# EasyEDA Pro project can-mcu.eprj, schematic main-board
Board Name: main-board; Create Date: 2026-08-05; Page Name: P1; Project Name: can-mcu; Schematic Name: main-board; Update Date: 2026-09-08; Company: EasyEDA.com; Page Size: A4; Version: V1.0
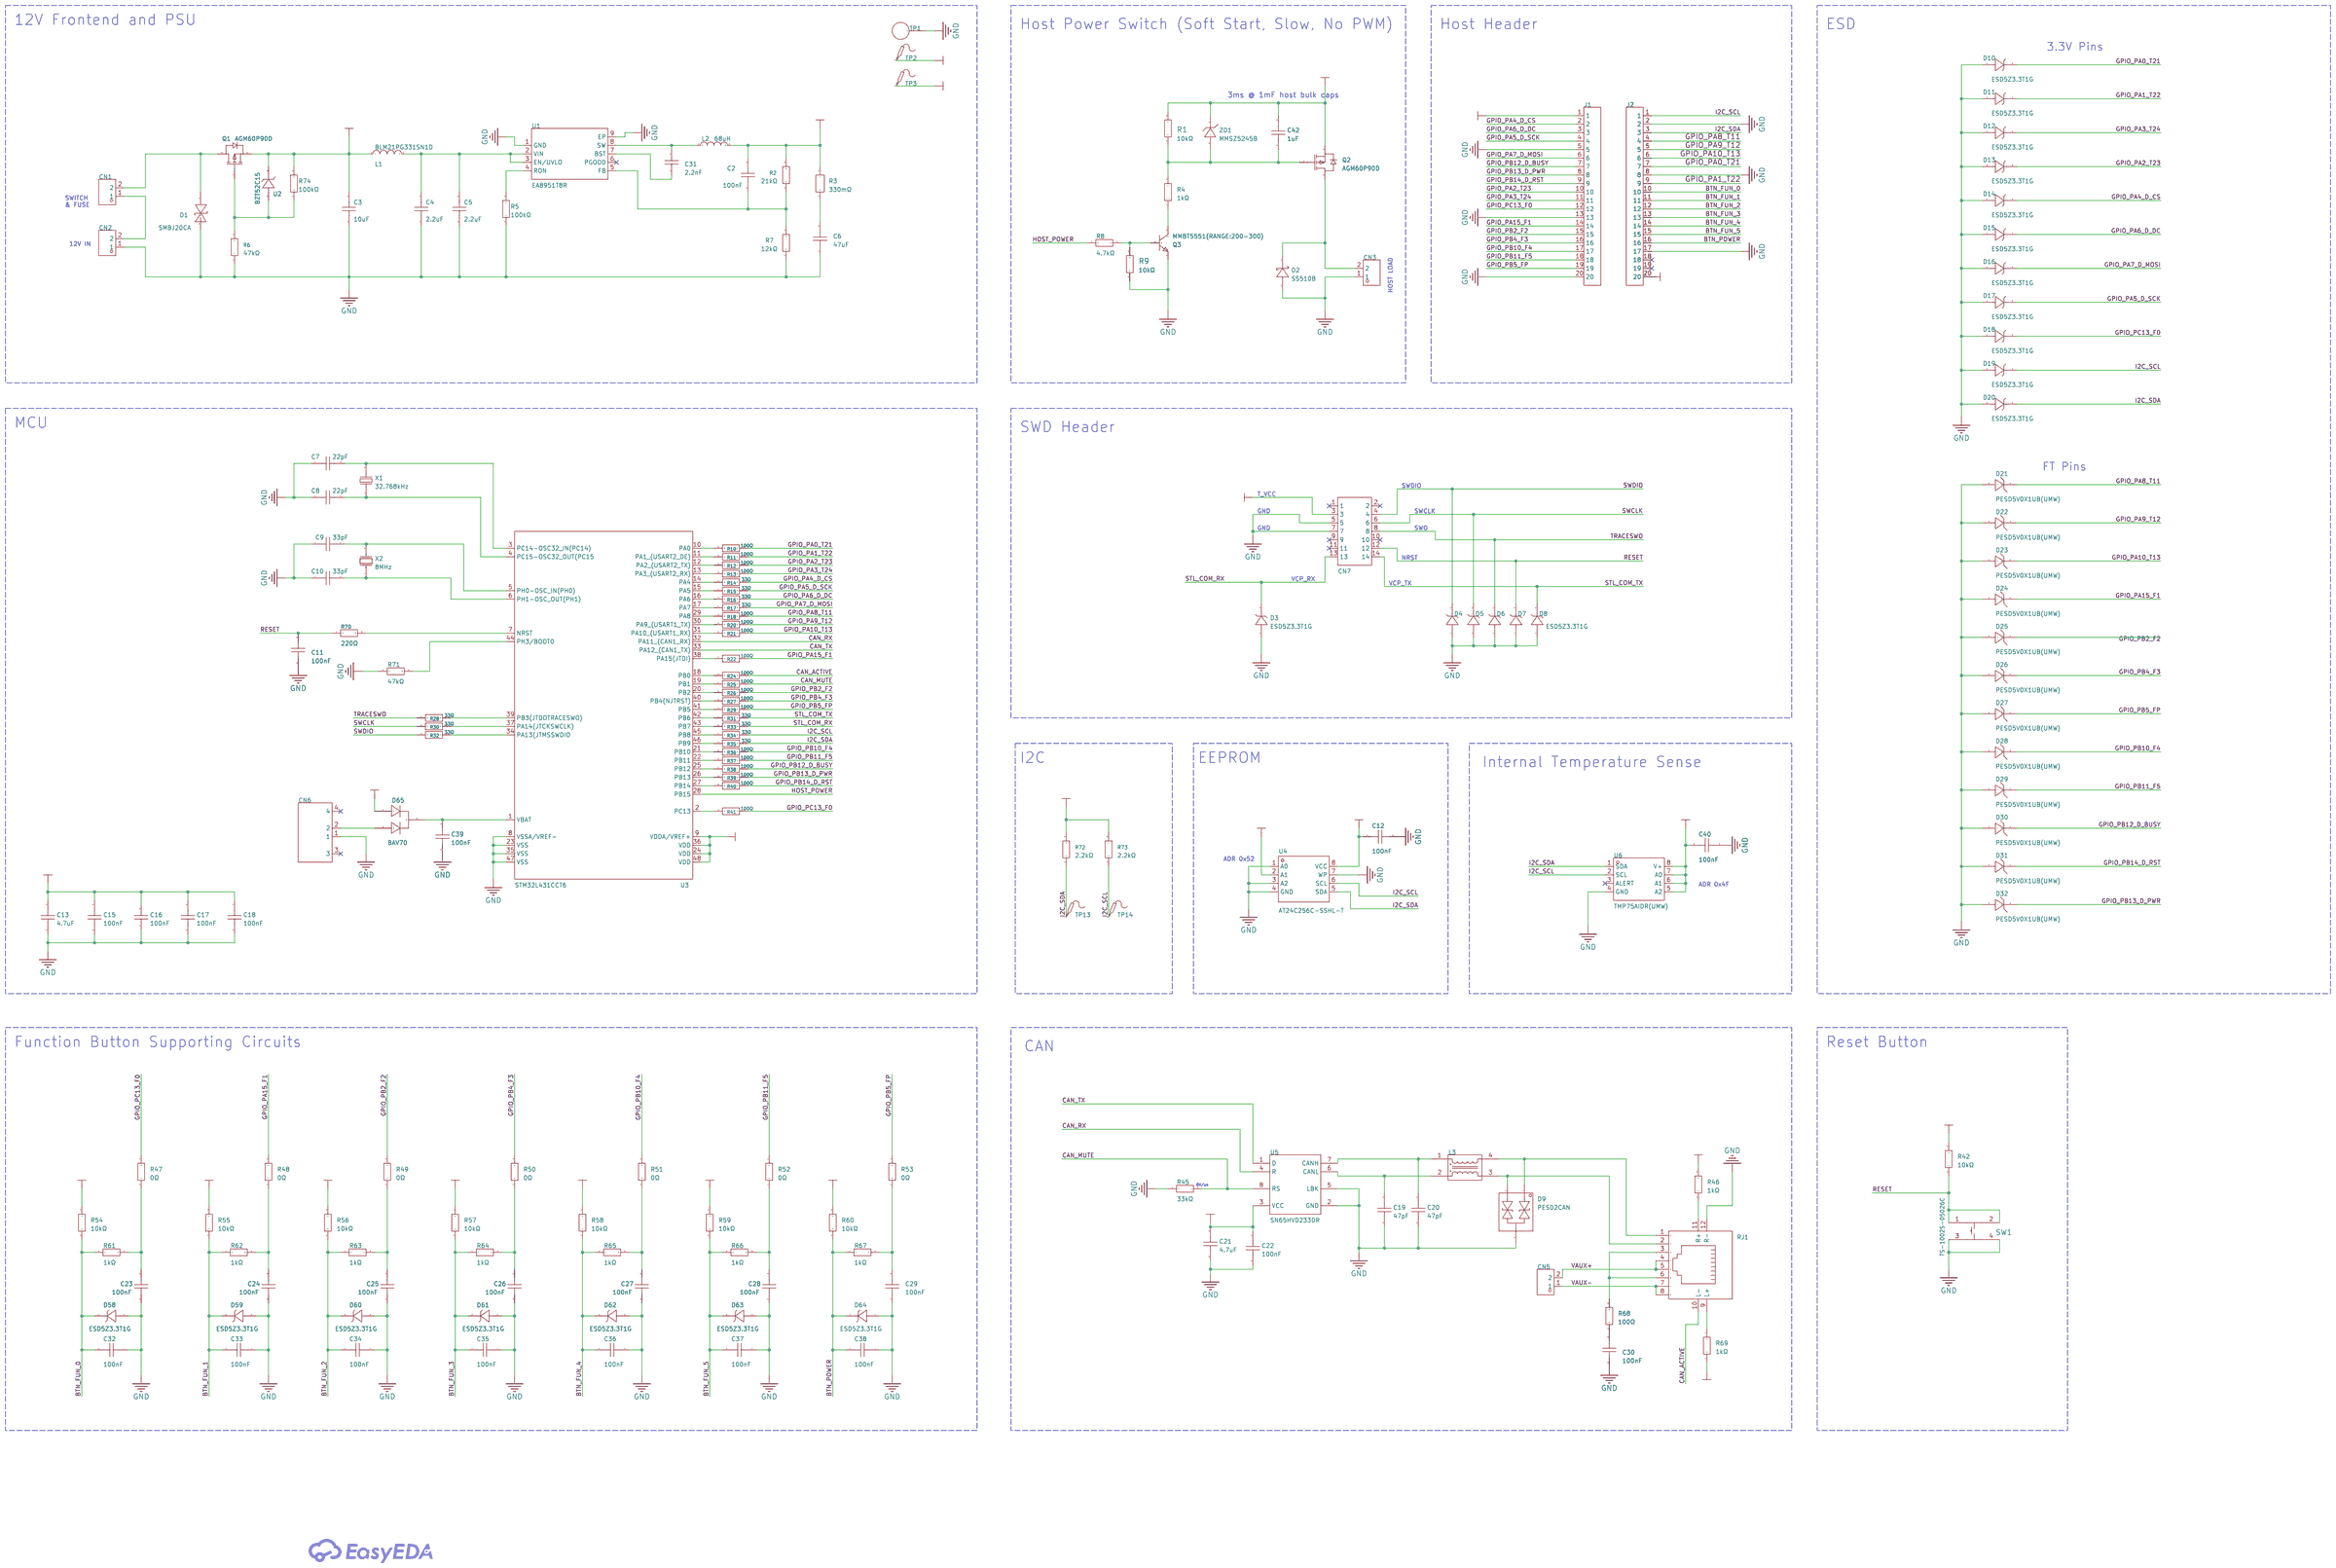
[diagram p0: schematic sheet]

## Parts
C2  100nF  [C0603]
C3  10uF  [C0805]
C4  2.2uF  [C0805]
C5  2.2uF  [C0805]
C6  47uF  [C1206]
C7  22pF  [C0603]
C8  22pF  [C0603]
C9  33pF  [C0603]
C10  33pF  [C0603]
C11  100nF  [C0603]
C12  100nF  [C0603]
C13  4.7uF  [C0603]
C15  100nF  [C0603]
C16  100nF  [C0603]
C17  100nF  [C0603]
C18  100nF  [C0603]
C19  47pF  [C0603]
C20  47pF  [C0603]
C21  4.7uF  [C0603]
C22  100nF  [C0603]
C23  100nF  [C0603]
C24  100nF  [C0603]
C25  100nF  [C0603]
C26  100nF  [C0603]
C27  100nF  [C0603]
C28  100nF  [C0603]
C29  100nF  [C0603]
C30  100nF  [C0603]
C31  2.2nF  [C0603]
C32  100nF  [C0603]
C33  100nF  [C0603]
C34  100nF  [C0603]
C35  100nF  [C0603]
C36  100nF  [C0603]
C37  100nF  [C0603]
C38  100nF  [C0603]
C39  100nF  [C0603]
C40  100nF  [C0603]
C42  1uF  [C0603]
CN1  DB2EVC-5.08-2P-GN  [CONN-TH_2P-P5.08_DB2EVC-5.08-2P]
CN2  DB2ERC-5.08-2P-GN  [CONN-TH_2P-P5.08_DB2ERC-5.08-2P]
CN3  DB2EVC-5.08-2P-GN  [CONN-TH_2P-P5.08_DB2EVC-5.08-2P]
CN5  DB2ERC-5.08-2P-GN  [CONN-TH_2P-P5.08_DB2ERC-5.08-2P]
CN6  BM02B-SRSS-TB(LF)(SN)  [CONN-TH_BM02B-SRSS-TB-LF-SN]
CN7  HX PZ1.27-2x7P WZ  [HDR-TH_14P-P1.27-H-M-R2-C7-S1.27-W7.5-N]
D1  SMBJ20CA  [SMB_L4.3-W3.6-LS5.4-BI]
D2  SS510B  [SMB_L4.6-W3.5-LS5.3-RD]
D3  ESD5Z3.3T1G  [SOD-523_L1.2-W0.8-LS1.6-FD]
D4  ESD5Z3.3T1G  [SOD-523_L1.2-W0.8-LS1.6-FD]
D5  ESD5Z3.3T1G  [SOD-523_L1.2-W0.8-LS1.6-FD]
D6  ESD5Z3.3T1G  [SOD-523_L1.2-W0.8-LS1.6-FD]
D7  ESD5Z3.3T1G  [SOD-523_L1.2-W0.8-LS1.6-FD]
D8  ESD5Z3.3T1G  [SOD-523_L1.2-W0.8-LS1.6-FD]
D9  PESD2CAN  [SOT-23-3_L2.9-W1.3-P1.90-LS2.4-BR]
D10  ESD5Z3.3T1G  [SOD-523_L1.2-W0.8-LS1.6-FD]
D11  ESD5Z3.3T1G  [SOD-523_L1.2-W0.8-LS1.6-FD]
D12  ESD5Z3.3T1G  [SOD-523_L1.2-W0.8-LS1.6-FD]
D13  ESD5Z3.3T1G  [SOD-523_L1.2-W0.8-LS1.6-FD]
D14  ESD5Z3.3T1G  [SOD-523_L1.2-W0.8-LS1.6-FD]
D15  ESD5Z3.3T1G  [SOD-523_L1.2-W0.8-LS1.6-FD]
D16  ESD5Z3.3T1G  [SOD-523_L1.2-W0.8-LS1.6-FD]
D17  ESD5Z3.3T1G  [SOD-523_L1.2-W0.8-LS1.6-FD]
D18  ESD5Z3.3T1G  [SOD-523_L1.2-W0.8-LS1.6-FD]
D19  ESD5Z3.3T1G  [SOD-523_L1.2-W0.8-LS1.6-FD]
D20  ESD5Z3.3T1G  [SOD-523_L1.2-W0.8-LS1.6-FD]
D21  PESD5V0X1UB(UMW)  [SOD-523_L1.2-W0.8-LS1.6-RD]
D22  PESD5V0X1UB(UMW)  [SOD-523_L1.2-W0.8-LS1.6-RD]
D23  PESD5V0X1UB(UMW)  [SOD-523_L1.2-W0.8-LS1.6-RD]
D24  PESD5V0X1UB(UMW)  [SOD-523_L1.2-W0.8-LS1.6-RD]
D25  PESD5V0X1UB(UMW)  [SOD-523_L1.2-W0.8-LS1.6-RD]
D26  PESD5V0X1UB(UMW)  [SOD-523_L1.2-W0.8-LS1.6-RD]
D27  PESD5V0X1UB(UMW)  [SOD-523_L1.2-W0.8-LS1.6-RD]
D28  PESD5V0X1UB(UMW)  [SOD-523_L1.2-W0.8-LS1.6-RD]
D29  PESD5V0X1UB(UMW)  [SOD-523_L1.2-W0.8-LS1.6-RD]
D30  PESD5V0X1UB(UMW)  [SOD-523_L1.2-W0.8-LS1.6-RD]
D31  PESD5V0X1UB(UMW)  [SOD-523_L1.2-W0.8-LS1.6-RD]
D32  PESD5V0X1UB(UMW)  [SOD-523_L1.2-W0.8-LS1.6-RD]
D58  ESD5Z3.3T1G  [SOD-523_L1.2-W0.8-LS1.6-FD]
D59  ESD5Z3.3T1G  [SOD-523_L1.2-W0.8-LS1.6-FD]
D60  ESD5Z3.3T1G  [SOD-523_L1.2-W0.8-LS1.6-FD]
D61  ESD5Z3.3T1G  [SOD-523_L1.2-W0.8-LS1.6-FD]
D62  ESD5Z3.3T1G  [SOD-523_L1.2-W0.8-LS1.6-FD]
D63  ESD5Z3.3T1G  [SOD-523_L1.2-W0.8-LS1.6-FD]
D64  ESD5Z3.3T1G  [SOD-523_L1.2-W0.8-LS1.6-FD]
D65  BAV70  [SOT-23-3_L3.0-W1.7-P0.95-LS2.9-BR]
J1  2.54-1*20P直针  [HDR-TH_20P-P2.54-V-M-1]
J2  2.54-1*20P直针  [HDR-TH_20P-P2.54-V-M-1]
L1  BLM21PG331SN1D  [L0805]
L2  68uH  [IND-SMD_L5.8-W5.2]
L3  WCM3225F2SF-601T10  [FILTER-SMD_4P-L3.2-W2.5-TL_ACM3225]
Q1  AGM60P90D  [TO-252-2_L6.6-W6.1-P4.57-LS9.9-BR-CW]
Q2  AGM60P90D  [TO-252-2_L6.6-W6.1-P4.57-LS9.9-BR-CW]
Q3  MMBT5551(RANGE:200-300)  [SOT-23-3_L2.9-W1.3-P1.90-LS2.4-BR]
R1  10kΩ  [R0603]
R2  21kΩ  [R0603]
R3  330mΩ  [R0603]
R4  1kΩ  [R0603]
R5  100kΩ  [R0603]
R6  47kΩ  [R0603]
R7  12kΩ  [R0603]
R8  4.7kΩ  [R0603]
R9  10kΩ  [R0603]
R10  100Ω  [R0402]
R11  100Ω  [R0402]
R12  100Ω  [R0402]
R13  100Ω  [R0402]
R14  33Ω  [R0402]
R15  33Ω  [R0402]
R16  33Ω  [R0402]
R17  33Ω  [R0402]
R18  100Ω  [R0402]
R20  100Ω  [R0402]
R21  100Ω  [R0402]
R22  100Ω  [R0402]
R24  100Ω  [R0402]
R25  100Ω  [R0402]
R26  100Ω  [R0402]
R27  100Ω  [R0402]
R28  33Ω  [R0402]
R29  100Ω  [R0402]
R30  33Ω  [R0402]
R31  33Ω  [R0402]
R32  33Ω  [R0402]
R33  33Ω  [R0402]
R34  33Ω  [R0402]
R35  33Ω  [R0402]
R36  100Ω  [R0402]
R37  100Ω  [R0402]
R38  100Ω  [R0402]
R39  100Ω  [R0402]
R40  100Ω  [R0402]
R41  100Ω  [R0402]
R42  10kΩ  [R0603]
R45  33kΩ  [R0603]
R46  1kΩ  [R0603]
R47  0Ω  [R1206]
R48  0Ω  [R1206]
R49  0Ω  [R1206]
R50  0Ω  [R1206]
R51  0Ω  [R1206]
R52  0Ω  [R1206]
R53  0Ω  [R1206]
R54  10kΩ  [R0603]
R55  10kΩ  [R0603]
R56  10kΩ  [R0603]
R57  10kΩ  [R0603]
R58  10kΩ  [R0603]
R59  10kΩ  [R0603]
R60  10kΩ  [R0603]
R61  1kΩ  [R0603]
R62  1kΩ  [R0603]
R63  1kΩ  [R0603]
R64  1kΩ  [R0603]
R65  1kΩ  [R0603]
R66  1kΩ  [R0603]
R67  1kΩ  [R0603]
R68  100Ω  [R1206]
R69  1kΩ  [R0603]
R70  220Ω  [R0402]
R71  47kΩ  [R0402]
R72  2.2kΩ  [R0402]
R73  2.2kΩ  [R0402]
R74  100kΩ  [R0603]
RJ1  HC-RJ45-5JA-1-5  [RJ45-TH_HC-RJ45-5JA-1-5]
SW1  TS-1002S-05026C  [KEY-SMD_4P-L6.0-W6.0-P4.50-LS9.0]
TP1  RH-5004  [TESTPOINT_TH_BD2.5-D1.2]  (no BOM)
TP2  -  [Test-Point-0.5mm]  (no BOM)
TP3  -  [Test-Point-0.5mm]  (no BOM)
TP13  -  [Test-Point-0.5mm]  (no BOM)
TP14  -  [Test-Point-0.5mm]  (no BOM)
U1  EA8951T8R  [ESOP-8_L4.9-W3.9-P1.27-LS6.0-BL-EP-2]
U2  BZT52C15  [SOD-123_L2.7-W1.6-LS3.8-RD]
U3  STM32L431CCT6  [LQFP-48_L7.0-W7.0-P0.50-LS9.0-BL]
U4  AT24C256C-SSHL-T  [SOIC-8_L4.9-W3.9-P1.27-LS6.0-BL]
U5  SN65HVD233DR  [SOIC-8_L5.0-W4.0-P1.27-LS6.0-BL]
U6  TMP75AIDR(UMW)  [SOP-8_L4.9-W3.9-P1.27-LS6.0-BL]
X1  32.768kHz  [FC-135R_L3.2-W1.5]
X2  8MHz  [CRYSTAL-SMD_L5.0-W3.2]
ZD1  MMSZ5245B  [SOD-123_L2.8-W1.8-LS3.7-RD]

## Library data of the parts
C2 C11 C12 C15-C18 C22-C30 C32-C40 = CC0603KRX7R9BB104: Capacitance:100nF Tolerance:±10% Tolerance:±10% Voltage Rating:50V Temperature Coefficient:X7R; LCSC Part Name: 100nF ±10% 50V; Supplier Part: C14663; Manufacturer: YAGEO(国巨); Supplier Footprint: 0603; JLCPCB Part Class: Basic Part; Datasheet: https://item.szlcsc.com/datasheet/CC0603KRX7R9BB104/15331.html; Supplier: LCSC; Tolerance: ±10%; Voltage Rating: 50V; Temperature Coefficient: X7R
C3 = GRM21BR61H106KE43L: LCSC Part Name: 10uF ±10% 50V; Supplier Part: C440198; Manufacturer: muRata(村田); Supplier Footprint: 0805; JLCPCB Part Class: Basic Part; Datasheet: https://item.szlcsc.com/datasheet/GRM21BR61H106KE43L/439567.html; Supplier: LCSC; Tolerance: ±10%; Voltage Rating: 50V; Temperature Coefficient: X5R
C4 C5 = CL21A225KBQNNNE: LCSC Part Name: 2.2uF ±10% 50V; Supplier Part: C377773; Manufacturer: SAMSUNG(三星); Supplier Footprint: 0805; Datasheet: https://item.szlcsc.com/datasheet/CL21A225KBQNNNE/350246.html; Supplier: LCSC; Tolerance: ±10%; Voltage Rating: 50V; Temperature Coefficient: X5R
C6 = CL31A476MPHNNNE: LCSC Part Name: 47uF ±20% 10V; Supplier Part: C96123; Manufacturer: SAMSUNG(三星); Supplier Footprint: 1206; Datasheet: https://item.szlcsc.com/datasheet/CL31A476MPHNNNE/97327.html; Supplier: LCSC; Tolerance: ±20%; Voltage Rating: 10V; Temperature Coefficient: X5R
C7 C8 = CL10C220JB8NNNC: Capacitance:22pF Tolerance:±5% Tolerance:±5% Voltage Rating:50V Temperature Coefficient:C0G; LCSC Part Name: 22pF ±5% 50V; Supplier Part: C1653; Manufacturer: SAMSUNG(三星); Supplier Footprint: 0603; JLCPCB Part Class: Basic Part; Datasheet: https://item.szlcsc.com/datasheet/CL10C220JB8NNNC/2005.html; Supplier: LCSC; Tolerance: ±5%; Voltage Rating: 50V; Temperature Coefficient: C0G
C9 C10 = CL10C330JB8NNNC: Capacitance:33pF Tolerance:±5% Tolerance:±5% Voltage Rating:50V Temperature Coefficient:C0G; LCSC Part Name: 33pF ±5% 50V; Supplier Part: C1663; Manufacturer: SAMSUNG(三星); Supplier Footprint: 0603; JLCPCB Part Class: Basic Part; Datasheet: https://item.szlcsc.com/datasheet/CL10C330JB8NNNC/2015.html; Supplier: LCSC; Tolerance: ±5%; Voltage Rating: 50V; Temperature Coefficient: C0G
C13 C21 = CL10A475KO8NNNC: Capacitance:4.7uF Tolerance:±10% Tolerance:±10% Voltage Rating:16V Temperature Coefficient:X5R; LCSC Part Name: 4.7uF ±10% 16V; Supplier Part: C19666; Manufacturer: SAMSUNG(三星); Supplier Footprint: 0603; JLCPCB Part Class: Basic Part; Datasheet: https://item.szlcsc.com/datasheet/CL10A475KO8NNNC/20375.html; Supplier: LCSC; Tolerance: ±10%; Voltage Rating: 16V; Temperature Coefficient: X5R
C19 C20 = CL10C470JB8NNNC: Capacitance:47pF Tolerance:±5% Tolerance:±5% Voltage Rating:50V Temperature Coefficient:C0G; LCSC Part Name: 47pF ±5% 50V; Supplier Part: C1671; Manufacturer: SAMSUNG(三星); Supplier Footprint: 0603; JLCPCB Part Class: Basic Part; Datasheet: https://item.szlcsc.com/datasheet/CL10C470JB8NNNC/2023.html; Supplier: LCSC; Tolerance: ±5%; Voltage Rating: 50V; Temperature Coefficient: C0G
C31 = 0603B222K500NT: LCSC Part Name: 2.2nF ±10% 50V; Supplier Part: C1604; Manufacturer: FH(风华); Supplier Footprint: 0603; Datasheet: https://item.szlcsc.com/datasheet/0603B222K500NT/1956.html; Supplier: LCSC; Tolerance: ±10%; Voltage Rating: 50V; Temperature Coefficient: X7R
C42 = CL10A105KB8NNNC: Capacitance:1uF Tolerance:±10% Tolerance:±10% Voltage Rating:50V Temperature Coefficient:X5R; LCSC Part Name: 1uF ±10% 50V; Supplier Part: C15849; Manufacturer: SAMSUNG(三星); Supplier Footprint: 0603; JLCPCB Part Class: Basic Part; Datasheet: https://item.szlcsc.com/datasheet/CL10A105KB8NNNC/16531.html; Supplier: LCSC; Tolerance: ±10%; Voltage Rating: 50V; Temperature Coefficient: X5R
CN1 CN3 = DB2EVC-5.08-2P-GN: LCSC Part Name: 1x2P 5.08mm 排数:1 每排P数:2; Supplier Part: C395734; Manufacturer: DORABO(地博电气); Supplier Footprint: 插件,P=5.08mm; Datasheet: https://item.szlcsc.com/datasheet/DB2EVC-5.08-2P-GN/376481.html; Supplier: LCSC; Connector Type: Board Side/Socket - Closed; Number of Positions or Pins: 1x2P; Pitch: 5.08mm; Color: Green; Mounting Type: Through Hole; Number of Pins: 2P; Number of Rows: 1; Number of PINs Per Row: 2; Current Rating: 15A; Voltage Rating (Max): 630V; Operating Temperature: -40℃~+105℃
CN2 CN5 = DB2ERC-5.08-2P-GN: LCSC Part Name: 1x2P 5.08mm 排数:1 每排P数:2; Supplier Part: C395737; Manufacturer: DORABO(地博电气); Supplier Footprint: 弯插,P=5.08mm; Datasheet: https://item.szlcsc.com/datasheet/DB2ERC-5.08-2P-GN/376484.html; Supplier: LCSC; Connector Type: Board Side/Socket - Closed; Number of Positions or Pins: 1x2P; Pitch: 5.08mm; Color: Green; Mounting Type: Right-Angle; Number of Pins: 2P; Number of Rows: 1; Number of PINs Per Row: 2; Current Rating: 15A; Voltage Rating (Max): 630V; Operating Temperature: -40℃~+105℃
CN6 = BM02B-SRSS-TB(LF)(SN): LCSC Part Name: 1x2P 间距:1mm 立贴 系列:SH; Supplier Part: C160388; Manufacturer: JST; Supplier Footprint: SMD,P=1mm; Datasheet: https://item.szlcsc.com/datasheet/BM02B-SRSS-TB(LF)(SN)/171768.html; Supplier: LCSC; Pins Structure: 1x2P; Pitch: 1mm; Mounting Type: Surface Mount,Vertical; Reference Series: SH; Number of Pins: 2P; Number of Rows: 1; Number of PINs Per Row: 2; Current Rating: 1A; Contact Material: Copper alloy; Contact Plating: Tin; Operating Temperature: -25℃~+85℃; Voltage Rating: 50V; Plastic Material: PA; Flame Retardant Rating: UL94V-0; Supplementary Features: Auxiliary Solder Pin; Color: White; Z-Height of the Board: 4.25mm; X-Length of Bottom Edge on Board (Spacing Line): 4mm; Y-Width of Bottom Edge on Board: 3.6mm
CN7 = HX PZ1.27-2x7P WZ: Pin Structure:2x7P Pitch:1.27mm Row Spacing:1.27mm Circluar Pins/Square Pins:Pin Header Mounting Type:Right Angle Number of Rows:2 Number of Pins:14P Current Rating:1A Voltage Rating (Max):500V Length of Mating Pin:4mm Insulation Height:1mm Length of End; LCSC Part Name: 2x7P 间距:1.27mm 方针 弯插; Supplier Part: C22438113; Manufacturer: hanxia(韩下); Supplier Footprint: 弯插,P=1.27mm; JLCPCB Part Class: Extended Part; Datasheet: https://item.szlcsc.com/datasheet/HX%2520PZ1.27-2x7P%2520WZ/24075358.html; Supplier: LCSC; Pin Structure: 2x7P; Pitch: 1.27mm; Row Spacing: 1.27mm; Circluar Pins/Square Pins: Pin Header; Mounting Type: Right Angle; Number of Rows: 2; Number of Pins: 14P; Current Rating: 1A; Voltage Rating (Max): 500V; Length of Mating Pin: 4mm; Insulation Height: 1mm; Contact Material: Brass; Contact Plating: Gold; Operating Temperature: -40℃~+105℃; Color: Black
D1 = SMBJ20CA_C113992: LCSC Part Name: SMB 600W 20V 双向; Supplier Part: C113992; Manufacturer: MDD(辰达半导体); Supplier Footprint: DO-214AA(SMB); JLCPCB Part Class: Extended Part; Datasheet: https://item.szlcsc.com/datasheet/SMBJ20CA/115231.html; Supplier: LCSC; Polarity: Bidirectional; Reverse Stand-Off Voltage (Vrwm): 20V; Clamping Voltage: 32.4V; Peak Pulse Current (Ipp): 18.6A@10/1000us; Peak Pulse Power Dissipation (Ppp): 600W@10/1000us; Voltage - Breakdown: 24.5V; Reverse Leakage Current (Ir): 1uA; Operating Temperature: -65℃~+150℃; Type: TVS
D2 = SS510B_C7420368: LCSC Part Name: 电压:100V 电流:5A; Supplier Part: C7420368; Manufacturer: R+O(宏嘉诚); Supplier Footprint: SMB; Datasheet: https://item.szlcsc.com/datasheet/SS510B/8397190.html; Supplier: LCSC; Diode Configuration: Independent; Voltage - Forward(Vf@If): 850mV@5A; Voltage - DC Reverse(Vr): 100V; Current - Rectified: 5A; Reverse Leakage Current (Ir): 50uA@100V; Operating Junction Temperature Range: -55℃~+150℃; Non-Repetitive Peak Forward Surge Current: 120A
D3-D8 D10-D20 D58-D64 = ESD5Z3.3T1G: LCSC Part Name: 单向ESD 3.3V截止 峰值浪涌电流：11A; Supplier Part: C2827729; Manufacturer: TECH PUBLIC(台舟); Supplier Footprint: SOD-523; Datasheet: https://item.szlcsc.com/datasheet/ESD5Z3.3T1G/2973411.html; Supplier: LCSC; Polarity: Unidirectional; Reverse Stand-Off Voltage (Vrwm): 3.3V; Clamping Voltage: 14V; Peak Pulse Current (Ipp): 11A; Peak Pulse Power Dissipation (Ppp): 150W; Voltage - Breakdown: 5V; Reverse Leakage Current (Ir): 200nA; Number of Channels: 1; Operating Temperature: -55℃~+125℃; level of protection: IEC 61000-4-2；IEC 61000-4-4; Type: ESD; Junction Capacitance: 110pF
D9 = PESD2CAN: Reverse Stand-Off Voltage (Vrwm):24V Clamping Voltage:54V Peak Pulse Current (Ipp):8A@8/20us Voltage - Breakdown:26.7V Type:TVS; Supplier Part: C284078; Manufacturer: DOWO(东沃); Supplier Footprint: SOT-23; JLCPCB Part Class: Extended Part; Datasheet: https://item.szlcsc.com/datasheet/PESD2CAN/269579.html; Supplier: LCSC; Reverse Stand-Off Voltage (Vrwm): 24V; Clamping Voltage: 54V; Peak Pulse Current (Ipp): 8A@8/20us; Voltage - Breakdown: 26.7V; Type: TVS
D21-D32 = PESD5V0X1UB(UMW): LCSC Part Name: 单向ESD 5.5V截止 峰值浪涌电流：1.5A@8/20us; Supplier Part: C19185924; Manufacturer: UMW(友台半导体); Supplier Footprint: SOD-523; JLCPCB Part Class: Extended Part; Datasheet: https://item.szlcsc.com/datasheet/PESD5V0X1UB(UMW)/20403729.html; Supplier: LCSC; Polarity: Unidirectional; Reverse Stand-Off Voltage (Vrwm): 5.5V; Clamping Voltage: 8V; Peak Pulse Current (Ipp): 1.5A@8/20us; Voltage - Breakdown: 7.5V; Reverse Leakage Current (Ir): 1nA; Number of Channels: 1; Operating Temperature: -55℃~+150℃; level of protection: IEC 61000-4-2; Type: ESD; Junction Capacitance: 0.95pF
D65 = BAV70_C68978: LCSC Part Name: 70V 200mA; Supplier Part: C68978; Manufacturer: CJ(江苏长电/长晶); Supplier Footprint: SOT-23; Datasheet: https://item.szlcsc.com/datasheet/BAV70/70091.html; Supplier: LCSC; Diode Configuration: 1 Pair Common Cathode; Pd - Power Dissipation: 225mW; Current - Rectified: 200mA; Voltage - DC Reverse(Vr): 70V; Voltage - Forward(Vf@If): 1.25V@150mA; Non-Repetitive Peak Forward Surge Current: 2A; Reverse Leakage Current (Ir): 2.5uA@70V; Reverse Recovery Time (trr): 6ns; Operating Junction Temperature Range: -55℃~+150℃
J1 J2 = 2.54-1*20P直针: LCSC Part Name: 1x20P 间距:2.54mm 方针 直插; Supplier Part: C50981; Manufacturer: BOOMELE(博穆精密); Supplier Footprint: 插件,P=2.54mm; JLCPCB Part Class: Extended Part; Datasheet: https://item.szlcsc.com/datasheet/2.54-1*20P%25E7%259B%25B4%25E9%2592%2588/51993.html; Supplier: LCSC; Pin Structure: 1x20P; Pitch: 2.54mm; Circluar Pins/Square Pins: Pin Header; Mounting Type: Through Hole; Number of Rows: 1; Number of Pins: 20P; Current Rating: 3A; Contact Material: Brass; Operating Temperature: -40℃~+105℃; Color: Black
L1 = BLM21PG331SN1D: Impedance @ Frequency:330Ω@100MHz Tolerance:±25% Tolerance:±25% DC Resistance(DCR):70mΩ Current Rating:1.5A Number of Circuits:1; LCSC Part Name: 单路 0805磁珠 阻抗330Ω@100MHz; Supplier Part: C74764; Manufacturer: muRata(村田); Supplier Footprint: 0805; JLCPCB Part Class: Extended Part; Datasheet: https://item.szlcsc.com/datasheet/BLM21PG331SN1D/75886.html; Supplier: LCSC; Impedance @ Frequency: 330Ω@100MHz; Tolerance: ±25%; DC Resistance(DCR): 70mΩ; Current Rating: 1.5A; Number of Circuits: 1
L2 = CY54-68UH: LCSC Part Name: 68uH ±10%; Supplier Part: C2929435; Manufacturer: SHOU HAN(首韩); Supplier Footprint: SMD,5.8x5.2mm; Datasheet: https://atta.szlcsc.com/upload/public/pdf/source/20211213/2CA85409B3B1311983E9E122C3568FF5.pdf; Supplier: LCSC; Tolerance: ±10%
L3 = WCM3225F2SF-601T10: Number of Lines:2 Current Rating:1A Impedance @ Frequency:600Ω@100MHz Voltage Rating - DC:50V Voltage Withstand:125V DC Resistance(DCR):200mΩ Operating Temperature:-40℃~+125℃ Operating Temperature:-40℃~+125℃ Insulation Resistance(IR):10MΩ; LCSC Part Name: 两路 贴片共模滤波器 阻抗600Ω@100MHz; Supplier Part: C192894; Manufacturer: TAI-TECH(台庆); Supplier Footprint: SMD-4P,3.2x2.5mm; JLCPCB Part Class: Extended Part; Datasheet: https://item.szlcsc.com/datasheet/WCM3225F2SF-601T10/225854.html; Supplier: LCSC; Number of Lines: 2; Current Rating: 1A; Impedance @ Frequency: 600Ω@100MHz; Voltage Rating - DC: 50V; Voltage Withstand: 125V; DC Resistance(DCR): 200mΩ; Operating Temperature: -40℃~+125℃; Insulation Resistance(IR): 10MΩ; Height: 2.2mm
Q1 Q2 = AGM60P90D: LCSC Part Name: 1个P沟道 耐压:60V 电流:90A; Supplier Part: C5464761; Manufacturer: AGMSEMI(芯控源); Supplier Footprint: TO-252; Datasheet: https://item.szlcsc.com/datasheet/AGM60P90D/6380593.html; Supplier: LCSC; Number: 1 P-Channel; Drain to Source Voltage: 60V; Current - Continuous Drain(Id): 90A; RDS(on): 8.2mΩ@10V；10mΩ@4.5V; Pd - Power Dissipation: 125W; Gate Threshold Voltage (Vgs(th)): 1.7V@250uA; Gate Charge(Qg): 138nC@10V; Input Capacitance(Ciss): 8.005nF; Reverse Transfer Capacitance (Crss@Vds): 265pF; Operating Temperature: -55℃~+150℃@(Tj); Output Capacitance(Coss): 296pF
Q3 = MMBT5551(RANGE:200-300): LCSC Part Name: hfe=200~300; Supplier Part: C2145; Manufacturer: CJ(江苏长电/长晶); Supplier Footprint: SOT-23; Datasheet: https://atta.szlcsc.com/upload/public/pdf/source/20140321/1457707027001.pdf; Supplier: LCSC; type: NPN; Collector - Emitter Voltage VCEO: 160V; Pd - Power Dissipation: 300mW; DC Current Gain: 200@10mA,5V; Transition frequency(fT): 100MHz; Current - Collector Cutoff: 50nA; Vce Saturation(VCE(sat)): 150mV; Operating Temperature: -55℃~+150℃
R1 R9 R42 R54-R60 = 0603WAF1002T5E: Type:Thick Film Resistor Resistance:10kΩ Tolerance:±1% Tolerance:±1% Power(Watts):100mW Voltage-Supply(Max):75V Temperature Coefficient:±100ppm/℃ Temperature Coefficient:±100ppm/℃ Operating Temperature:-55℃~+155℃ Operating Temperature:-55℃~+155℃; LCSC Part Name: 厚膜电阻 10kΩ ±1% 100mW; Supplier Part: C25804; Manufacturer: UNI-ROYAL(厚声); Supplier Footprint: 0603; JLCPCB Part Class: Basic Part; Datasheet: https://item.szlcsc.com/datasheet/0603WAF1002T5E/26547.html; Supplier: LCSC; Type: Thick Film Resistor; Tolerance: ±1%; Power(Watts): 100mW; Voltage-Supply(Max): 75V; Temperature Coefficient: ±100ppm/℃; Operating Temperature: -55℃~+155℃
R2 = 0603WAF2102T5E: LCSC Part Name: 21kΩ ±1% 100mW 厚膜电阻; Supplier Part: C22956; Manufacturer: UNI-ROYAL(厚声); Supplier Footprint: 0603; JLCPCB Part Class: Extended Part; Datasheet: https://item.szlcsc.com/datasheet/0603WAF2102T5E/23683.html; Supplier: LCSC; Type: Thick Film Resistor; Tolerance: ±1%; Power(Watts): 100mW; Voltage-Supply(Max): 75V; Temperature Coefficient: ±100ppm/℃; Operating Temperature: -55℃~+155℃
R3 = FRL0603JR330TS: LCSC Part Name: 330mΩ ±5% 100mW 厚膜电阻; Supplier Part: C2998166; Manufacturer: FOJAN(富捷); Supplier Footprint: 0603; Datasheet: https://item.szlcsc.com/datasheet/FRL0603JR330TS/3471524.html; Supplier: LCSC; Type: Thick Film Resistor; Tolerance: ±5%; Power(Watts): 100mW; Voltage-Supply(Max): 100V; Temperature Coefficient: ±300ppm/℃; Operating Temperature: -55℃~+155℃
R4 R61-R67 = 0603WAF1001T5E: Type:Thick Film Resistors Resistance:1kΩ Tolerance:±1% Tolerance:±1% Power(Watts): Overload Voltage (Max): Temperature Coefficient:±100ppm/℃ Temperature Coefficient:±100ppm/℃ Operating Temperature Range:-55℃~+155℃ Operating Temperature Range:-55℃~+155℃; LCSC Part Name: 1kΩ ±1% 100mW 厚膜电阻; Supplier Part: C21190; Manufacturer: UNI-ROYAL(厚声); Supplier Footprint: 0603; JLCPCB Part Class: Basic Part; Datasheet: https://atta.szlcsc.com/upload/public/pdf/source/20200306/C422600_1E6D84923E4A46A82E41ADD87F860B5C.pdf; Supplier: LCSC; Type: Thick Film Resistors; Tolerance: ±1%; Temperature Coefficient: ±100ppm/℃; Operating Temperature Range: -55℃~+155℃
R5 R74 = 0603WAF1003T5E: Type:Thick Film Resistor Resistance:100kΩ Tolerance:±1% Tolerance:±1% Power(Watts):100mW Voltage-Supply(Max):75V Temperature Coefficient:±100ppm/℃ Temperature Coefficient:±100ppm/℃ Operating Temperature:-55℃~+155℃ Operating Temperature:-55℃~+155℃; LCSC Part Name: 100kΩ ±1% 100mW 厚膜电阻; Supplier Part: C25803; Manufacturer: UNI-ROYAL(厚声); Supplier Footprint: 0603; JLCPCB Part Class: Basic Part; Datasheet: https://item.szlcsc.com/datasheet/0603WAF1003T5E/26546.html; Supplier: LCSC; Type: Thick Film Resistor; Tolerance: ±1%; Power(Watts): 100mW; Voltage-Supply(Max): 75V; Temperature Coefficient: ±100ppm/℃; Operating Temperature: -55℃~+155℃
R6 = 0603WAF4702T5E: Type:Thick Film Resistor Resistance:47kΩ Tolerance:±1% Tolerance:±1% Power(Watts):100mW Voltage-Supply(Max):75V Temperature Coefficient:±100ppm/℃ Temperature Coefficient:±100ppm/℃ Operating Temperature:-55℃~+155℃ Operating Temperature:-55℃~+155℃; LCSC Part Name: 47kΩ ±1% 100mW 厚膜电阻; Supplier Part: C25819; Manufacturer: UNI-ROYAL(厚声); Supplier Footprint: 0603; JLCPCB Part Class: Basic Part; Datasheet: https://item.szlcsc.com/datasheet/0603WAF4702T5E/26562.html; Supplier: LCSC; Type: Thick Film Resistor; Tolerance: ±1%; Power(Watts): 100mW; Voltage-Supply(Max): 75V; Temperature Coefficient: ±100ppm/℃; Operating Temperature: -55℃~+155℃
R7 = 0603WAF1202T5E: LCSC Part Name: 12kΩ ±1% 100mW 厚膜电阻; Supplier Part: C22790; Manufacturer: UNI-ROYAL(厚声); Supplier Footprint: 0603; Datasheet: https://item.szlcsc.com/datasheet/0603WAF1202T5E/23517.html; Supplier: LCSC; Type: Thick Film Resistor; Tolerance: ±1%; Power(Watts): 100mW; Voltage-Supply(Max): 75V; Temperature Coefficient: ±100ppm/℃; Operating Temperature: -55℃~+155℃
R8 = 0603WAF4701T5E: Type:Thick Film Resistor Resistance:4.7kΩ Tolerance:±1% Tolerance:±1% Power(Watts):100mW Voltage-Supply(Max):75V Temperature Coefficient:±100ppm/℃ Temperature Coefficient:±100ppm/℃ Operating Temperature:-55℃~+155℃ Operating Temperature:-55℃~+155℃; LCSC Part Name: 4.7kΩ ±1% 100mW 厚膜电阻; Supplier Part: C23162; Manufacturer: UNI-ROYAL(厚声); Supplier Footprint: 0603; JLCPCB Part Class: Basic Part; Datasheet: https://item.szlcsc.com/datasheet/0603WAF4701T5E/23889.html; Supplier: LCSC; Type: Thick Film Resistor; Tolerance: ±1%; Power(Watts): 100mW; Voltage-Supply(Max): 75V; Temperature Coefficient: ±100ppm/℃; Operating Temperature: -55℃~+155℃
R10-R13 R18 R20-R22 R24-R27 R29 R36-R41 = 0402WGF1000TCE: Type:Thick Film Resistor Resistance:100Ω Tolerance:±1% Tolerance:±1% Power(Watts):62.5mW Voltage-Supply(Max):50V Temperature Coefficient:±100ppm/℃ Temperature Coefficient:±100ppm/℃ Operating Temperature:-55℃~+155℃ Operating Temperature:-55℃~+155℃; LCSC Part Name: 100Ω ±1% 62.5mW 厚膜电阻; Supplier Part: C25076; Manufacturer: UNI-ROYAL(厚声); Supplier Footprint: 0402; JLCPCB Part Class: Basic Part; Datasheet: https://item.szlcsc.com/datasheet/0402WGF1000TCE/25819.html; Supplier: LCSC; Type: Thick Film Resistor; Tolerance: ±1%; Power(Watts): 62.5mW; Voltage-Supply(Max): 50V; Temperature Coefficient: ±100ppm/℃; Operating Temperature: -55℃~+155℃
R14-R17 R28 R30-R35 = 0402WGF330JTCE: LCSC Part Name: 33Ω ±1% 62.5mW 厚膜电阻; Supplier Part: C25105; Manufacturer: UNI-ROYAL(厚声); Supplier Footprint: 0402; Datasheet: https://item.szlcsc.com/datasheet/0402WGF330JTCE/25848.html; Supplier: LCSC; Type: Thick Film Resistor; Tolerance: ±1%; Power(Watts): 62.5mW; Voltage-Supply(Max): 50V; Temperature Coefficient: ±100ppm/℃; Operating Temperature: -55℃~+155℃
R45 = 0603WAF3302T5E: Type:Thick Film Resistor Resistance:33kΩ Tolerance:±1% Tolerance:±1% Power(Watts):100mW Voltage-Supply(Max):75V Temperature Coefficient:±100ppm/℃ Temperature Coefficient:±100ppm/℃ Operating Temperature:-55℃~+155℃ Operating Temperature:-55℃~+155℃; LCSC Part Name: 33kΩ ±1% 100mW 厚膜电阻; Supplier Part: C4216; Manufacturer: UNI-ROYAL(厚声); Supplier Footprint: 0603; JLCPCB Part Class: Basic Part; Datasheet: https://item.szlcsc.com/datasheet/0603WAF3302T5E/4623.html; Supplier: LCSC; Type: Thick Film Resistor; Tolerance: ±1%; Power(Watts): 100mW; Voltage-Supply(Max): 75V; Temperature Coefficient: ±100ppm/℃; Operating Temperature: -55℃~+155℃
R46 R69 = 0603WAF1001T5E: Type:Thick Film Resistor Resistance:1kΩ Tolerance:±1% Tolerance:±1% Power(Watts):100mW Voltage-Supply(Max):75V Temperature Coefficient:±100ppm/℃ Temperature Coefficient:±100ppm/℃ Operating Temperature:-55℃~+155℃ Operating Temperature:-55℃~+155℃; LCSC Part Name: 1kΩ ±1% 100mW 厚膜电阻; Supplier Part: C21190; Manufacturer: UNI-ROYAL(厚声); Supplier Footprint: 0603; JLCPCB Part Class: Basic Part; Datasheet: https://atta.szlcsc.com/upload/public/pdf/source/20200306/C422600_1E6D84923E4A46A82E41ADD87F860B5C.pdf; Supplier: LCSC; Type: Thick Film Resistors; Tolerance: ±1%; Power(Watts): 100mW; Temperature Coefficient: ±100ppm/℃; Operating Temperature Range: -55℃~+155℃; Voltage-Supply(Max): 75V; Operating Temperature: -55℃~+155℃
R47-R53 = 1206W4F0000T5E: Type:Thick Film Resistor Resistance:0Ω Tolerance:±1% Tolerance:±1% Power(Watts):250mW Voltage-Supply(Max):200V Temperature Coefficient:±800ppm/℃ Temperature Coefficient:±800ppm/℃ Operating Temperature:-55℃~+155℃ Operating Temperature:-55℃~+155℃; LCSC Part Name: 0Ω ±1% 250mW 厚膜电阻; Supplier Part: C17888; Manufacturer: UNI-ROYAL(厚声); Supplier Footprint: 1206; JLCPCB Part Class: Basic Part; Datasheet: https://item.szlcsc.com/datasheet/1206W4F0000T5E/18576.html; Supplier: LCSC; Type: Thick Film Resistor; Tolerance: ±1%; Power(Watts): 250mW; Voltage-Supply(Max): 200V; Temperature Coefficient: ±800ppm/℃; Operating Temperature: -55℃~+155℃
R68 = 1206W4F1000T5E_C17901: Type:Thick Film Resistor Resistance:100Ω Tolerance:±1% Tolerance:±1% Power(Watts):250mW Voltage-Supply(Max):200V Temperature Coefficient:±100ppm/℃ Temperature Coefficient:±100ppm/℃ Operating Temperature:-55℃~+155℃ Operating Temperature:-55℃~+155℃; LCSC Part Name: 100Ω ±1% 250mW 厚膜电阻; Supplier Part: C17901; Manufacturer: UNI-ROYAL(厚声); Manufacturer Part: 1206W4F1000T5E; Supplier Footprint: 1206; JLCPCB Part Class: Basic Part; Datasheet: https://item.szlcsc.com/datasheet/1206W4F1000T5E/18589.html; Supplier: LCSC; Type: Thick Film Resistor; Tolerance: ±1%; Power(Watts): 250mW; Voltage-Supply(Max): 200V; Temperature Coefficient: ±100ppm/℃; Operating Temperature: -55℃~+155℃
R70 = 0402WGF2200TCE: LCSC Part Name: 220Ω ±1% 62.5mW 厚膜电阻; Supplier Part: C25091; Manufacturer: UNI-ROYAL(厚声); Supplier Footprint: 0402; Datasheet: https://item.szlcsc.com/datasheet/0402WGF2200TCE/25834.html; Supplier: LCSC; Type: Thick Film Resistor; Tolerance: ±1%; Power(Watts): 62.5mW; Voltage-Supply(Max): 50V; Temperature Coefficient: ±100ppm/℃; Operating Temperature: -55℃~+155℃
R71 = 0402WGF4702TCE: LCSC Part Name: 47kΩ ±1% 62.5mW 厚膜电阻; Supplier Part: C25792; Manufacturer: UNI-ROYAL(厚声); Supplier Footprint: 0402; Datasheet: https://item.szlcsc.com/datasheet/0402WGF4702TCE/26535.html; Supplier: LCSC; Type: Thick Film Resistor; Tolerance: ±1%; Power(Watts): 62.5mW; Voltage-Supply(Max): 50V; Temperature Coefficient: ±100ppm/℃; Operating Temperature: -55℃~+155℃
R72 R73 = 0402WGF2201TCE: LCSC Part Name: 2.2kΩ ±1% 62.5mW 厚膜电阻; Supplier Part: C25879; Manufacturer: UNI-ROYAL(厚声); Supplier Footprint: 0402; JLCPCB Part Class: Basic Part; Datasheet: https://item.szlcsc.com/datasheet/0402WGF2201TCE/26622.html; Supplier: LCSC; Type: Thick Film Resistor; Tolerance: ±1%; Power(Watts): 62.5mW; Voltage-Supply(Max): 50V; Temperature Coefficient: ±100ppm/℃; Operating Temperature: -55℃~+155℃
RJ1 = HC-RJ45-5JA-1-5: LCSC Part Name: 弯插 带LED; Supplier Part: C3000175; Manufacturer: HCTL(华灿天禄); Supplier Footprint: 弯插; Datasheet: https://item.szlcsc.com/datasheet/HC-RJ45-5JA-1-5/3480958.html; Supplier: LCSC; Connector Type: RJ45 Jack; Mounting Type: Right Angle; Number of Ports: 1; LED: With LED; Shielding: Unshielded; Contact Material: Phosphor Bronze; Contact Plating: Gold
SW1 = TS-1002S-05026C: Circuit:SPST Actuator Style:Round Button Mounting Type:Vertical welding Length:6mm Width:6mm Switch Height:5mm Contact Current:50mA Voltage Rating:12V With Lamp:- Life:-; LCSC Part Name: 6*6*5mm 立贴 轻触开关; Supplier Part: C455110; Manufacturer: XUNPU(讯普); Supplier Footprint: SMD,6x6mm; JLCPCB Part Class: Extended Part; Datasheet: https://atta.szlcsc.com/upload/public/pdf/source/20250513/F8F0C18C3D0EDC07DAC80A3CC3CDA783.pdf; Supplier: LCSC; Circuit: SPST; Actuator Style: Round Button; Mounting Type: Vertical welding; Length: 6mm; Width: 6mm; Switch Height: 5mm; Contact Current: 50mA; Voltage Rating: 12V
TP1 = RH-5004: Connector Type:Pin type (through board) Plastic Color:Yellow Board Space (Diameter φ/ Length x Width):2.5mm; LCSC Part Name: PCB电路板测试点/测试针; Supplier Part: C5199804; Manufacturer: 荣和; JLCPCB Part Class: Extended Part; Supplier: LCSC; Connector Type: Pin type (through board); Plastic Color: Yellow; Board Space (Diameter φ/ Length x Width): 2.5mm
TP2 TP3 TP13 TP14 = Test-Point: Test Point 测试点
U1 = EA8951T8R: LCSC Part Name: EA8951 低功耗COT同步降压转换器; Supplier Part: C54556651; Manufacturer: everanalog(申风); Supplier Footprint: ESOP-8; JLCPCB Part Class: Extended Part; Datasheet: https://item.szlcsc.com/datasheet/EA8951T8R/57920864.html; Supplier: LCSC; Function: Step-down type; Voltage - Supply: 6V~100V; Output Current: 1A; Frequency - Switching: 1MHz; Operating Temperature: -40℃~+105℃; Synchronous Rectifier: Yes; Number of Outputs: 1; Topology: Buck; Quiescent Current: 15uA; Switch tube (built-in/external): Built-in; Output Type: Adjustable; Features: Light load efficient mode；Built-in LDO regulator；Cycle-by-cycle current limiting；Overcurrent Protection；Operating status indication
U2 = BZT52C15_C2932746: Diode Configuration:Independent Zener Voltage(Nom):15V Reverse Leakage Current (Ir):100nA@10.5V Zener Voltage(Range):13.8V~15.6V Zener Voltage(Range):13.8V~15.6V Pd - Power Dissipation:500mW Impedance(Zzt):30Ω Impedance(Zzk):200Ω; LCSC Part Name: 齐纳二极管 15V 0.5W; Supplier Part: C2932746; Manufacturer: GOODWORK(固得沃克); Supplier Footprint: SOD-123; JLCPCB Part Class: Extended Part; Datasheet: https://item.szlcsc.com/datasheet/BZT52C15/3278303.html; Supplier: LCSC; Diode Configuration: Independent; Zener Voltage(Nom): 15V; Reverse Leakage Current (Ir): 100nA@10.5V; Zener Voltage(Range): 13.8V~15.6V; Pd - Power Dissipation: 500mW; Impedance(Zzt): 30Ω; Impedance(Zzk): 200Ω
U3 = STM32L431CCT6: CPU Core:ARM-M4 CPU Maximum Speed:80MHz Program Storage Size:256KB Program Memory Type:FLASH Number of I/O:39 ADC (Bit):12bit DAC (Bit):12bit Voltage - Supply:1.71V~3.6V Voltage - Supply:1.71V~3.6V Applications:-; LCSC Part Name: 带FPU的超低功耗80 Mhz Arm Cortex-M4 MCU，具有256-KB Flash存储器; Supplier Part: C486681; Manufacturer: ST(意法半导体); Supplier Footprint: LQFP-48(7x7); JLCPCB Part Class: Extended Part; Datasheet: https://item.szlcsc.com/datasheet/STM32L431CCT6/495115.html; Supplier: LCSC; CPU Core: ARM-M4; CPU Maximum Speed: 80MHz; Program Storage Size: 256KB; Program Memory Type: FLASH; Number of I/O: 39; ADC (Bit): 12bit; DAC (Bit): 12bit; Voltage - Supply: 1.71V~3.6V
U4 = AT24C256C-SSHL-T: Interface Type:I2C Memory Size:256Kbit Supply Voltage:1.7V~5.5V Supply Voltage:1.7V~5.5V Operating Temperature:-40℃~+85℃ Operating Temperature:-40℃~+85℃; Supplier Part: C6482; Manufacturer: MICROCHIP(美国微芯); Supplier Footprint: SOIC-8; JLCPCB Part Class: Extended Part; Datasheet: https://atta.szlcsc.com/upload/public/pdf/source/20140704/1457707098744.pdf; Supplier: LCSC; Interface Type: I2C; Memory Size: 256Kbit; Supply Voltage: 1.7V~5.5V; Operating Temperature: -40℃~+85℃
U5 = SN65HVD233DR: Type:CANtransceiver Data Rate:1Mbps Supply Voltage:3V~3.6V Supply Voltage:3V~3.6V Supply Current:6mA Operating Temperature:-40℃~+125℃ Operating Temperature:-40℃~+125℃; LCSC Part Name: SN65HVD233 3.3-V CAN总线收发器; Supplier Part: C61643; Manufacturer: TI(德州仪器); Supplier Footprint: SOIC-8; JLCPCB Part Class: Extended Part; Datasheet: https://www.ti.com/cn/lit/gpn/sn65hvd233; Supplier: LCSC; Type: CANtransceiver; Data Rate: 1Mbps; Supply Voltage: 3V~3.6V; Supply Current: 6mA; Operating Temperature: -40℃~+125℃
U6 = TMP75AIDR(UMW): LCSC Part Name: 具备I²C接口和报警功能的1.8V数字温度传感器; Supplier Part: C5158044; Manufacturer: UMW(友台半导体); Supplier Footprint: SOP-8; Datasheet: https://item.szlcsc.com/datasheet/TMP75AIDR(UMW)/5798356.html; Supplier: LCSC; Detection Temperature Range: -40℃~+125℃; Tolerance: ±0.5℃; Voltage - Supply: 1.4V~5.5V; Standby Current: 37uA; Interface: I2C; Temperature Conversion Time: 35ms; Temperature Resolution: 12bit; Features: Temperature threshold monitoring；Factory temperature calibration；Low-power standby
X1 = Q13FC13500004_C32346: Crystal Type:Surface Mount Crystal Frequency: Normal temperature Frequency Tolerance:±20ppm Normal temperature Frequency Tolerance:±20ppm Load Capacitor: Equivalent Series Resistance (ESR):70kΩ Operating Temperature: Operating Temperature:; LCSC Part Name: 32.768kHz ±20ppm 12.5pF; Supplier Part: C32346; Manufacturer: EPSON(爱普生); Manufacturer Part: Q13FC13500004; Supplier Footprint: SMD3215-2P; JLCPCB Part Class: Basic Part; Datasheet: https://atta.szlcsc.com/upload/public/pdf/source/20240418/0E0FF5F0356BA3753F616001439D1416.pdf; Supplier: LCSC; Crystal Type: Surface Mount Crystal; Normal temperature Frequency Tolerance: ±20ppm; Equivalent Series Resistance (ESR): 70kΩ
X2 = X50328MSB2GI: Type:Crystal Oscillator Frequency:8MHz Normal temperature Frequency Tolerance:±10ppm Normal temperature Frequency Tolerance:±10ppm Load Capacitance:20pF Frequency Stability:±20ppm Frequency Stability:±20ppm Operating Temperature:-40℃~+85℃ Operating Temper; LCSC Part Name: YSX530GA 8MHZ 2P 5032 20PF ±10PPM -40~85℃ (±20PPM); Supplier Part: C115962; Manufacturer: YXC(扬兴晶振); Supplier Footprint: SMD5032-2P; JLCPCB Part Class: Basic Part; Datasheet: https://item.szlcsc.com/datasheet/X50328MSB2GI/117214.html; Supplier: LCSC; Type: Crystal Oscillator; Normal temperature Frequency Tolerance: ±10ppm; Load Capacitance: 20pF; Frequency Stability: ±20ppm; Operating Temperature: -40℃~+85℃
ZD1 = MMSZ5245B_C2126: LCSC Part Name: 丝印H5 独立式 耐压:15V 电流:0.1uA; Supplier Part: C2126; Manufacturer: CJ(江苏长电/长晶); Supplier Footprint: SOD-123; JLCPCB Part Class: Extended Part; Datasheet: https://item.szlcsc.com/datasheet/MMSZ5245B/2483.html; Supplier: LCSC; Diode Configuration: 1 Independent; Zener Voltage(Nom): 15V; Reverse Leakage Current (Ir): 100nA; Zener Voltage(Range): 14.25V~15.75V; Pd - Power Dissipation: 350mW; Impedance(Zzt): 16Ω; Impedance(Zzk): 600Ω; Operating Junction Temperature Range: -65℃~+150℃

## Nets
+3V3: C2.2 C12.2 C13.1 C15.1 C16.2 C17.1 C18.1 C21.1 C22.1 C40.2 CN7.3 D65.1 J1.1 L2.2 R2.2 R3.2 R42.2 R46.2 R54.2 R55.2 R56.2 R57.2 R58.2 R59.2 R60.2 R69.2 R72.2 R73.2 TP3.1 U3.9(VDDA/VREF+) U3.24(VDD) U3.36(VDD) U3.48(VDD) U4.2(A1) U4.8(VCC) U5.3(VCC) U6.5(A2) U6.6(A1) U6.7(A0) U6.8(V+)
+12V: C3.2 C42.2 J2.20 L1.1 Q1.3(S) Q2.3(S) R1.2 R74.2 TP2.1 U2.1(K) ZD1.1(K)
GND: C3.1 C4.1 C5.1 C6.1 C7.1 C8.1 C9.1 C10.1 C11.1 C12.1 C13.2 C15.2 C16.1 C17.2 C18.2 C19.2 C20.2 C21.2 C22.2 C23.1 C24.1 C25.1 C26.1 C27.1 C28.1 C29.1 C30.1 C32.1 C33.1 C34.1 C35.1 C36.1 C37.1 C38.1 C39.2 C40.1 CN2.1 CN3.1 CN6.1 CN7.5 CN7.7 D1.2(K) D2.2(A) D3.1(A) D4.1(A) D5.1(A) D6.1(A) D7.1(A) D8.1(A) D9.3 D10.1(A) D11.1(A) D12.1(A) D13.1(A) D14.1(A) D15.1(A) D16.1(A) D17.1(A) D18.1(A) D19.1(A) D20.1(A) D21.2(A) D22.2(A) D23.2(A) D24.2(A) D25.2(A) D26.2(A) D27.2(A) D28.2(A) D29.2(A) D30.2(A) D31.2(A) D32.2(A) D58.1(A) D59.1(A) D60.1(A) D61.1(A) D62.1(A) D63.1(A) D64.1(A) J1.5 J1.13 J1.20 J2.2 J2.8 J2.17 Q3.2(E) R5.1 R6.1 R7.1 R9.1 R45.1 R71.1 RJ1.12(R-) SW1.3 SW1.4 TP1.1 U1.1(GND) U1.9(EP) U3.8(VSSA/VREF-) U3.23(VSS) U3.35(VSS) U3.47(VSS) U4.1(A0) U4.3(A2) U4.4(GND) U4.7(WP) U5.2(GND) U5.5(LBK) U6.4(GND)
BTN_FUN_0: C32.2 D58.2(K) J2.10 R54.1 R61.1
BTN_FUN_1: C33.2 D59.2(K) J2.11 R55.1 R62.1
BTN_FUN_2: C34.2 D60.2(K) J2.12 R56.1 R63.1
BTN_FUN_3: C35.2 D61.2(K) J2.13 R57.1 R64.1
BTN_FUN_4: C36.2 D62.2(K) J2.14 R58.1 R65.1
BTN_FUN_5: C37.2 D63.2(K) J2.15 R59.1 R66.1
BTN_POWER: C38.2 D64.2(K) J2.16 R60.1 R67.1
CAN_ACTIVE: R24.1 RJ1.10(L-)
CAN_MUTE: R25.1 R45.2 U5.8(RS)
CAN_RX: U3.32(PA11 (CAN1_RX)) U5.4(R)
CAN_TX: U3.33(PA12 (CAN1_TX)) U5.1(D)
GPIO_PA0_T21: D10.2(K) J2.7 R10.1
GPIO_PA1_T22: D11.2(K) J2.9 R11.1
GPIO_PA2_T23: D13.2(K) J1.10 R12.1
GPIO_PA3_T24: D12.2(K) J1.11 R13.1
GPIO_PA4_D_CS: D14.2(K) J1.2 R14.2
GPIO_PA5_D_SCK: D17.2(K) J1.4 R15.2
GPIO_PA6_D_DC: D15.2(K) J1.3 R16.2
GPIO_PA7_D_MOSI: D16.2(K) J1.6 R17.2
GPIO_PA8_T11: D21.1(C) J2.4 R18.1
GPIO_PA9_T12: D22.1(C) J2.5 R20.1
GPIO_PA10_T13: D23.1(C) J2.6 R21.1
GPIO_PA15_F1: D24.1(C) J1.14 R22.1 R48.2
GPIO_PB2_F2: D25.1(C) J1.15 R26.1 R49.2
GPIO_PB4_F3: D26.1(C) J1.16 R27.1 R50.2
GPIO_PB5_FP: D27.1(C) J1.19 R29.1 R53.2
GPIO_PB10_F4: D28.1(C) J1.17 R36.1 R51.2
GPIO_PB11_F5: D29.1(C) J1.18 R37.1 R52.2
GPIO_PB12_D_BUSY: D30.1(C) J1.7 R38.1
GPIO_PB13_D_PWR: D32.1(C) J1.8 R39.1
GPIO_PB14_D_RST: D31.1(C) J1.9 R40.1
GPIO_PC13_F0: D18.2(K) J1.12 R41.1 R47.2
HOST_POWER: R8.1 U3.28(PB15)
I2C_SCL: D19.2(K) J2.1 R34.2 R73.1 TP14.1 U4.6(SCL) U6.2(SCL)
I2C_SDA: D20.2(K) J2.3 R35.2 R72.1 TP13.1 U4.5(SDA) U6.1(SDA)
RESET: C11.2 CN7.12 D7.2(K) R42.1 R70.1 SW1.1 SW1.2
STL_COM_RX: CN7.13 D3.2(K) R33.2
STL_COM_TX: CN7.14 D8.2(K) R31.2
SWCLK: CN7.6 D5.2(K) R30.1
SWDIO: CN7.4 D4.2(K) R32.1
TRACESWO: CN7.8 D6.2(K) R28.1
VAUX+: CN5.2 RJ1.4 RJ1.5
VAUX-: CN5.1 RJ1.7 RJ1.8
$1N4416: C10.2 U3.6(PH1-OSC_OUT(PH1)) X2.1(OSC1)
$1N4417: C9.2 U3.5(PH0-OSC_IN(PH0)) X2.2(OSC2)
$1N4420: C39.1 D65.3 U3.1(VBAT)
$1N4427: R70.2 U3.7(NRST)
$1N4428: R71.2 U3.44(PH3/BOOT0)
$1N4429: R28.2 U3.39(PB3(JTDOTRACESWO))
$1N4431: R30.2 U3.37(PA14(JTCKSWCLK))
$1N4433: R32.2 U3.34(PA13(JTMSSWDIO)
$1N4455: R15.1 U3.15(PA5)
$1N4457: R17.1 U3.17(PA7)
$1N4459: R14.1 U3.14(PA4)
$1N4465: R16.1 U3.16(PA6)
$1N4470: C7.2 U3.3(PC14-OSC32_IN(PC14)) X1.2
$1N4471: C8.2 U3.4(PC15-OSC32_OUT(PC15) X1.1
$1N5665: C4.2 C5.2 L1.2 U1.2(VIN) U1.3(EN/UVLO)
$1N5782: R5.2 U1.4(RON)
$1N5823: C31.2 L2.1 U1.8(SW)
$1N5835: C31.1 U1.7(BST)
$1N5847: C2.1 R2.1 R7.2 U1.5(FB)
$1N6632: Q1.1(G) R6.2 R74.1 U2.2(A)
$1N7577: C6.2 R3.1
$1N8206: CN1.1 CN2.2
$1N8211: CN1.2 D1.1(A) Q1.2(D)
$1N11074: R33.1 U3.43(PB7)
$1N11077: R31.1 U3.42(PB6)
$1N11096: R34.1 U3.45(PB8)
$1N11100: R35.1 U3.46(PB9)
$1N11390: Q3.1(B) R8.2 R9.2
$1N11444: CN3.2 D2.1(K) Q2.2(D)
$1N11903: Q3.3(C) R4.1
$1N12475: R22.2 U3.38(PA15(JTDI))
$1N12477: R24.2 U3.18(PB0)
$1N12479: R25.2 U3.19(PB1)
$1N12481: R26.2 U3.20(PB2)
$1N12483: R27.2 U3.40(PB4(NJTRST))
$1N12485: R29.2 U3.41(PB5)
$1N12491: R36.2 U3.21(PB10)
$1N12495: R37.2 U3.22(PB11)
$1N12497: R38.2 U3.25(PB12)
$1N12499: R39.2 U3.26(PB13)
$1N12501: R40.2 U3.27(PB14)
$1N12505: R41.2 U3.2(PC13)
$1N14397: C20.1 L3.1 U5.7(CANH)
$1N14402: C19.1 L3.2 U5.6(CANL)
$1N14446: C30.2 R68.1
$1N14515: R68.2 RJ1.3 RJ1.6
$1N14552: D9.1 L3.4 RJ1.1
$1N14560: D9.2 L3.3 RJ1.2
$1N14808: C23.2 R47.1 R61.2
$1N14984: C24.2 R48.1 R62.2
$1N15029: C25.2 R49.1 R63.2
$1N15074: C26.2 R50.1 R64.2
$1N15119: C27.2 R51.1 R65.2
$1N15164: C28.2 R52.1 R66.2
$1N15209: C29.2 R53.1 R67.2
$1N19303: R46.1 RJ1.11(R+)
$1N19384: R69.1 RJ1.9(L+)
$1N19621: R13.2 U3.13(PA3 (USART2_RX))
$1N19661: R12.2 U3.12(PA2 (USART2_TX))
$1N19701: R10.2 U3.10(PA0)
$1N19741: R11.2 U3.11(PA1 (USART2_DE))
$1N19781: R18.2 U3.29(PA8)
$1N19821: R20.2 U3.30(PA9 (USART1_TX))
$1N19861: R21.2 U3.31(PA10 (USART1_RX))
$1N69046: CN6.2 D65.2
$1N87863: C42.1 Q2.1(G) R1.1 R4.2 ZD1.2(A)

Not connected (* = marked no-connect by the designer): CN6 3* 4*; CN7 1* 2* 9* 10* 11*; J2 18* 19*; U1 6(PGOOD)*; U6 3(ALERT)*

## Notes on the sheet
- 12V Frontend and PSU
- Host Power Switch (Soft Start, Slow, No PWM)
- Host Header
- ESD
- 3.3V Pins
- 3ms @ 1mF host bulk caps
- SWITCH
  & FUSE
- 12V IN
- HOST LOAD
- MCU
- SWD Header
- FT Pins
- SWDIO
- T_VCC
- GND
- SWCLK
- GND
- SWO
- NRST
- VCP_RX
- VCP_TX
- I2C
- EEPROM
- Internal Temperature Sense
- ADR 0x52
- ADR 0x4F
- Function Button Supporting Circuits
- Reset Button
- CAN
- 6V/us
